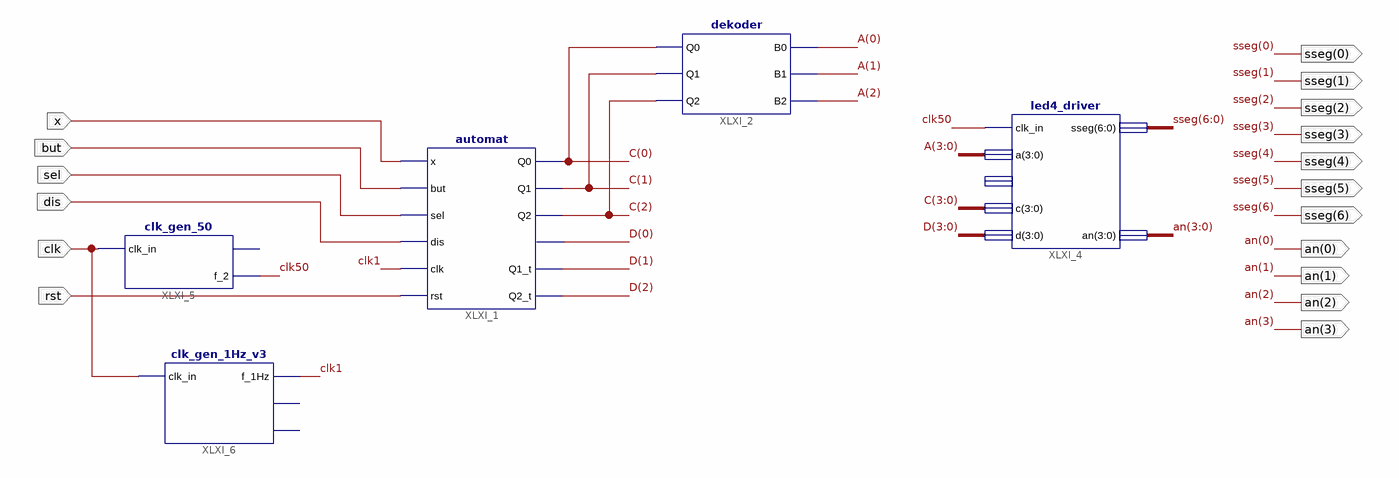
[diagram p0: schematic sheet 1]
// Xilinx ISE schematic symulacja.sch (spartan3e) as structural Verilog: 5 symbols, 17 ports
module symulacja (
  input  dis,
  input  sel,
  input  but,
  input  x,
  input  rst,
  input  clk,
  output [6:0] sseg,
  output [3:0] an
);

  wire clk1, clk50;
  wire [3:0] A, C, D;

  automat XLXI_1 (
    .dis(dis), .rst(rst), .sel(sel), .but(but), .clk(clk1), .x(x), .Q0(C[0]), .Q1(C[1]), .Q2(C[2]),
    .Q0_t(D[0]), .Q1_t(D[1]), .Q2_t(D[2]));
  dekoder XLXI_2 (.B0(A[0]), .B1(A[1]), .B2(A[2]), .Q2(C[2]), .Q1(C[1]), .Q0(C[0]));
  led4_driver XLXI_4 (.clk_in(clk50), .a(A), .c(C), .d(D), .sseg(sseg), .an(an));  // open: b
  clk_gen_50 XLXI_5 (.clk_in(clk), .f_2(clk50));  // open: f_1
  clk_gen_1Hz_v3 XLXI_6 (.clk_in(clk), .f_1Hz(clk1));  // open: f_1kHz, f_1MHz

  // Notes on the sheet:
  //   LOC on signal sseg(0) = L18
  //   LOC on signal sseg(1) = F18
  //   LOC on signal sseg(2) = D17
  //   LOC on signal sseg(3) = D16
  //   LOC on signal sseg(4) = G14
  //   LOC on signal sseg(5) = J17
  //   LOC on signal sseg(6) = H14
  //   LOC on signal an(0) = F17
  //   LOC on signal an(1) = H17
  //   LOC on signal an(2) = C18
  //   LOC on signal an(3) = F15
  //   LOC on signal dis = H18
  //   LOC on signal sel = G18
  //   LOC on signal but = B18
  //   LOC on signal x = R17
  //   LOC on signal rst = H13
  //   LOC on signal clk = B8
endmodule
